# EasyEDA Pro project car1.eprj, schematic Schematic2_2

## Sheets
1 control: Board Name: 主板第三版; Create Date: 2025-05-26; Page Name: control; Project Name: car1; Schematic Name: Schematic2_2; Update Date: 2025-06-05; Company: 嘉立创EDA; Page Size: A4; Version: V1.0
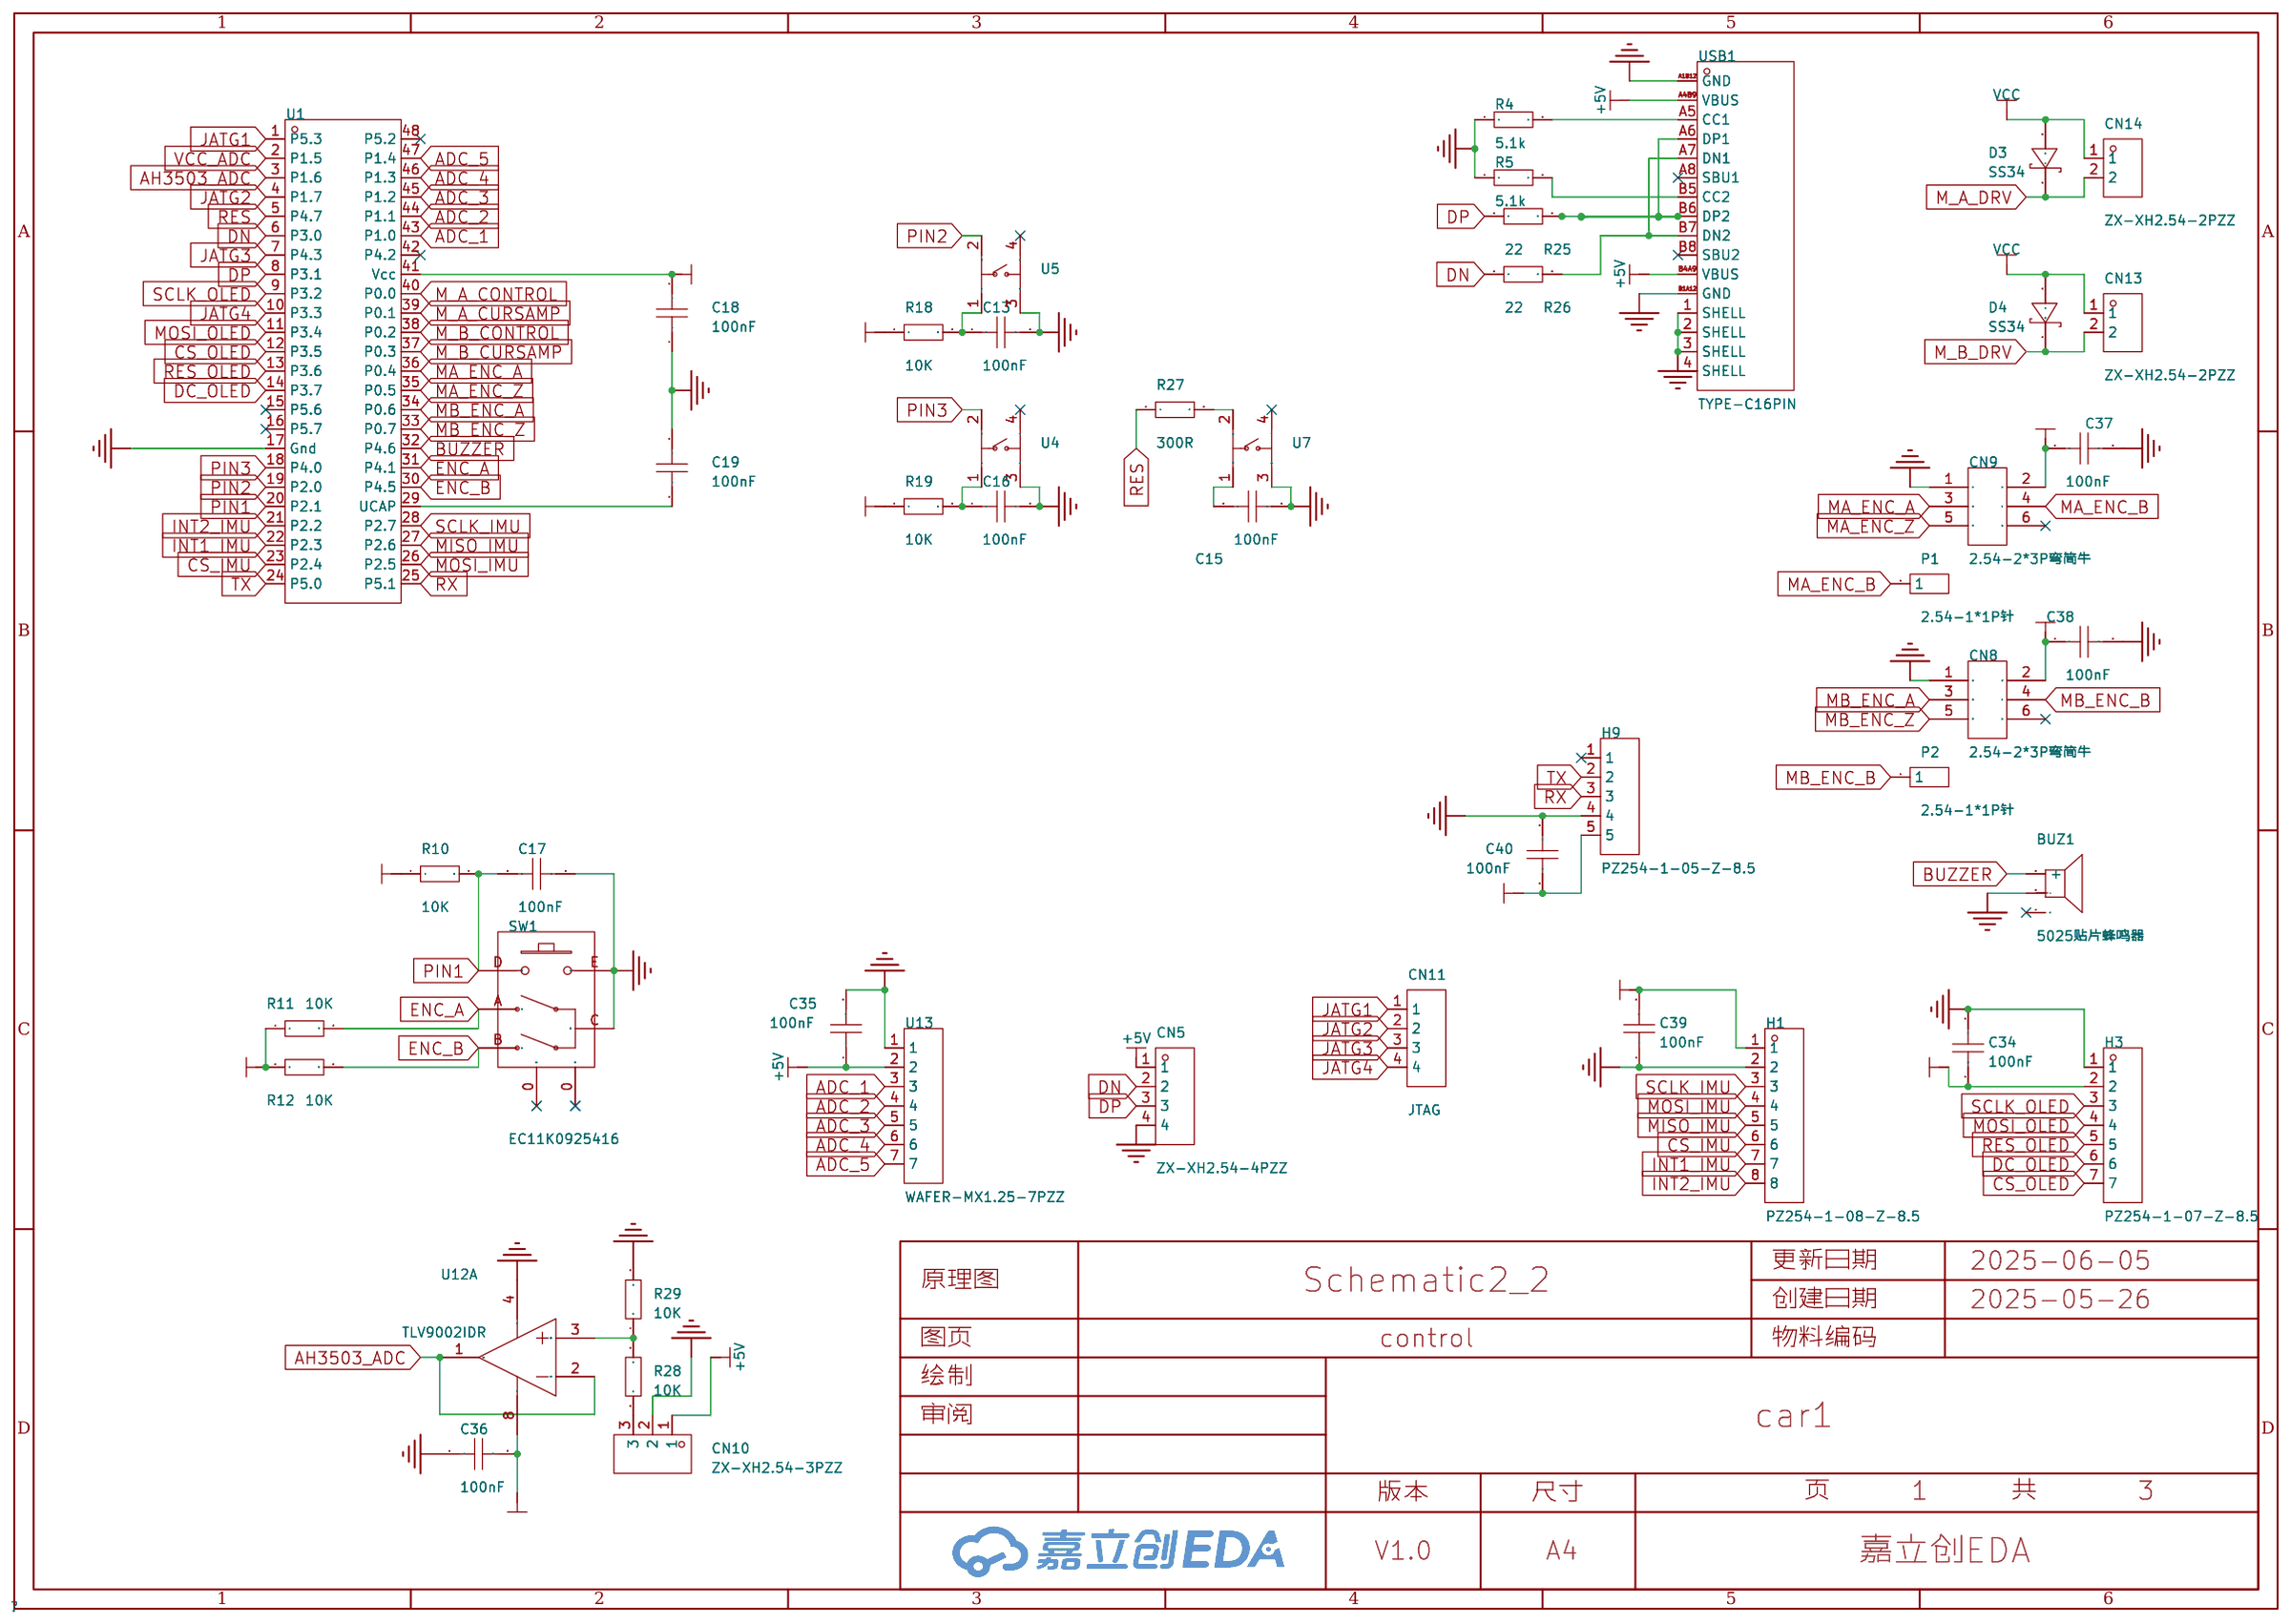
[diagram p7: control]
2 Power: Page Name: Power; Update Date: 2025-06-06
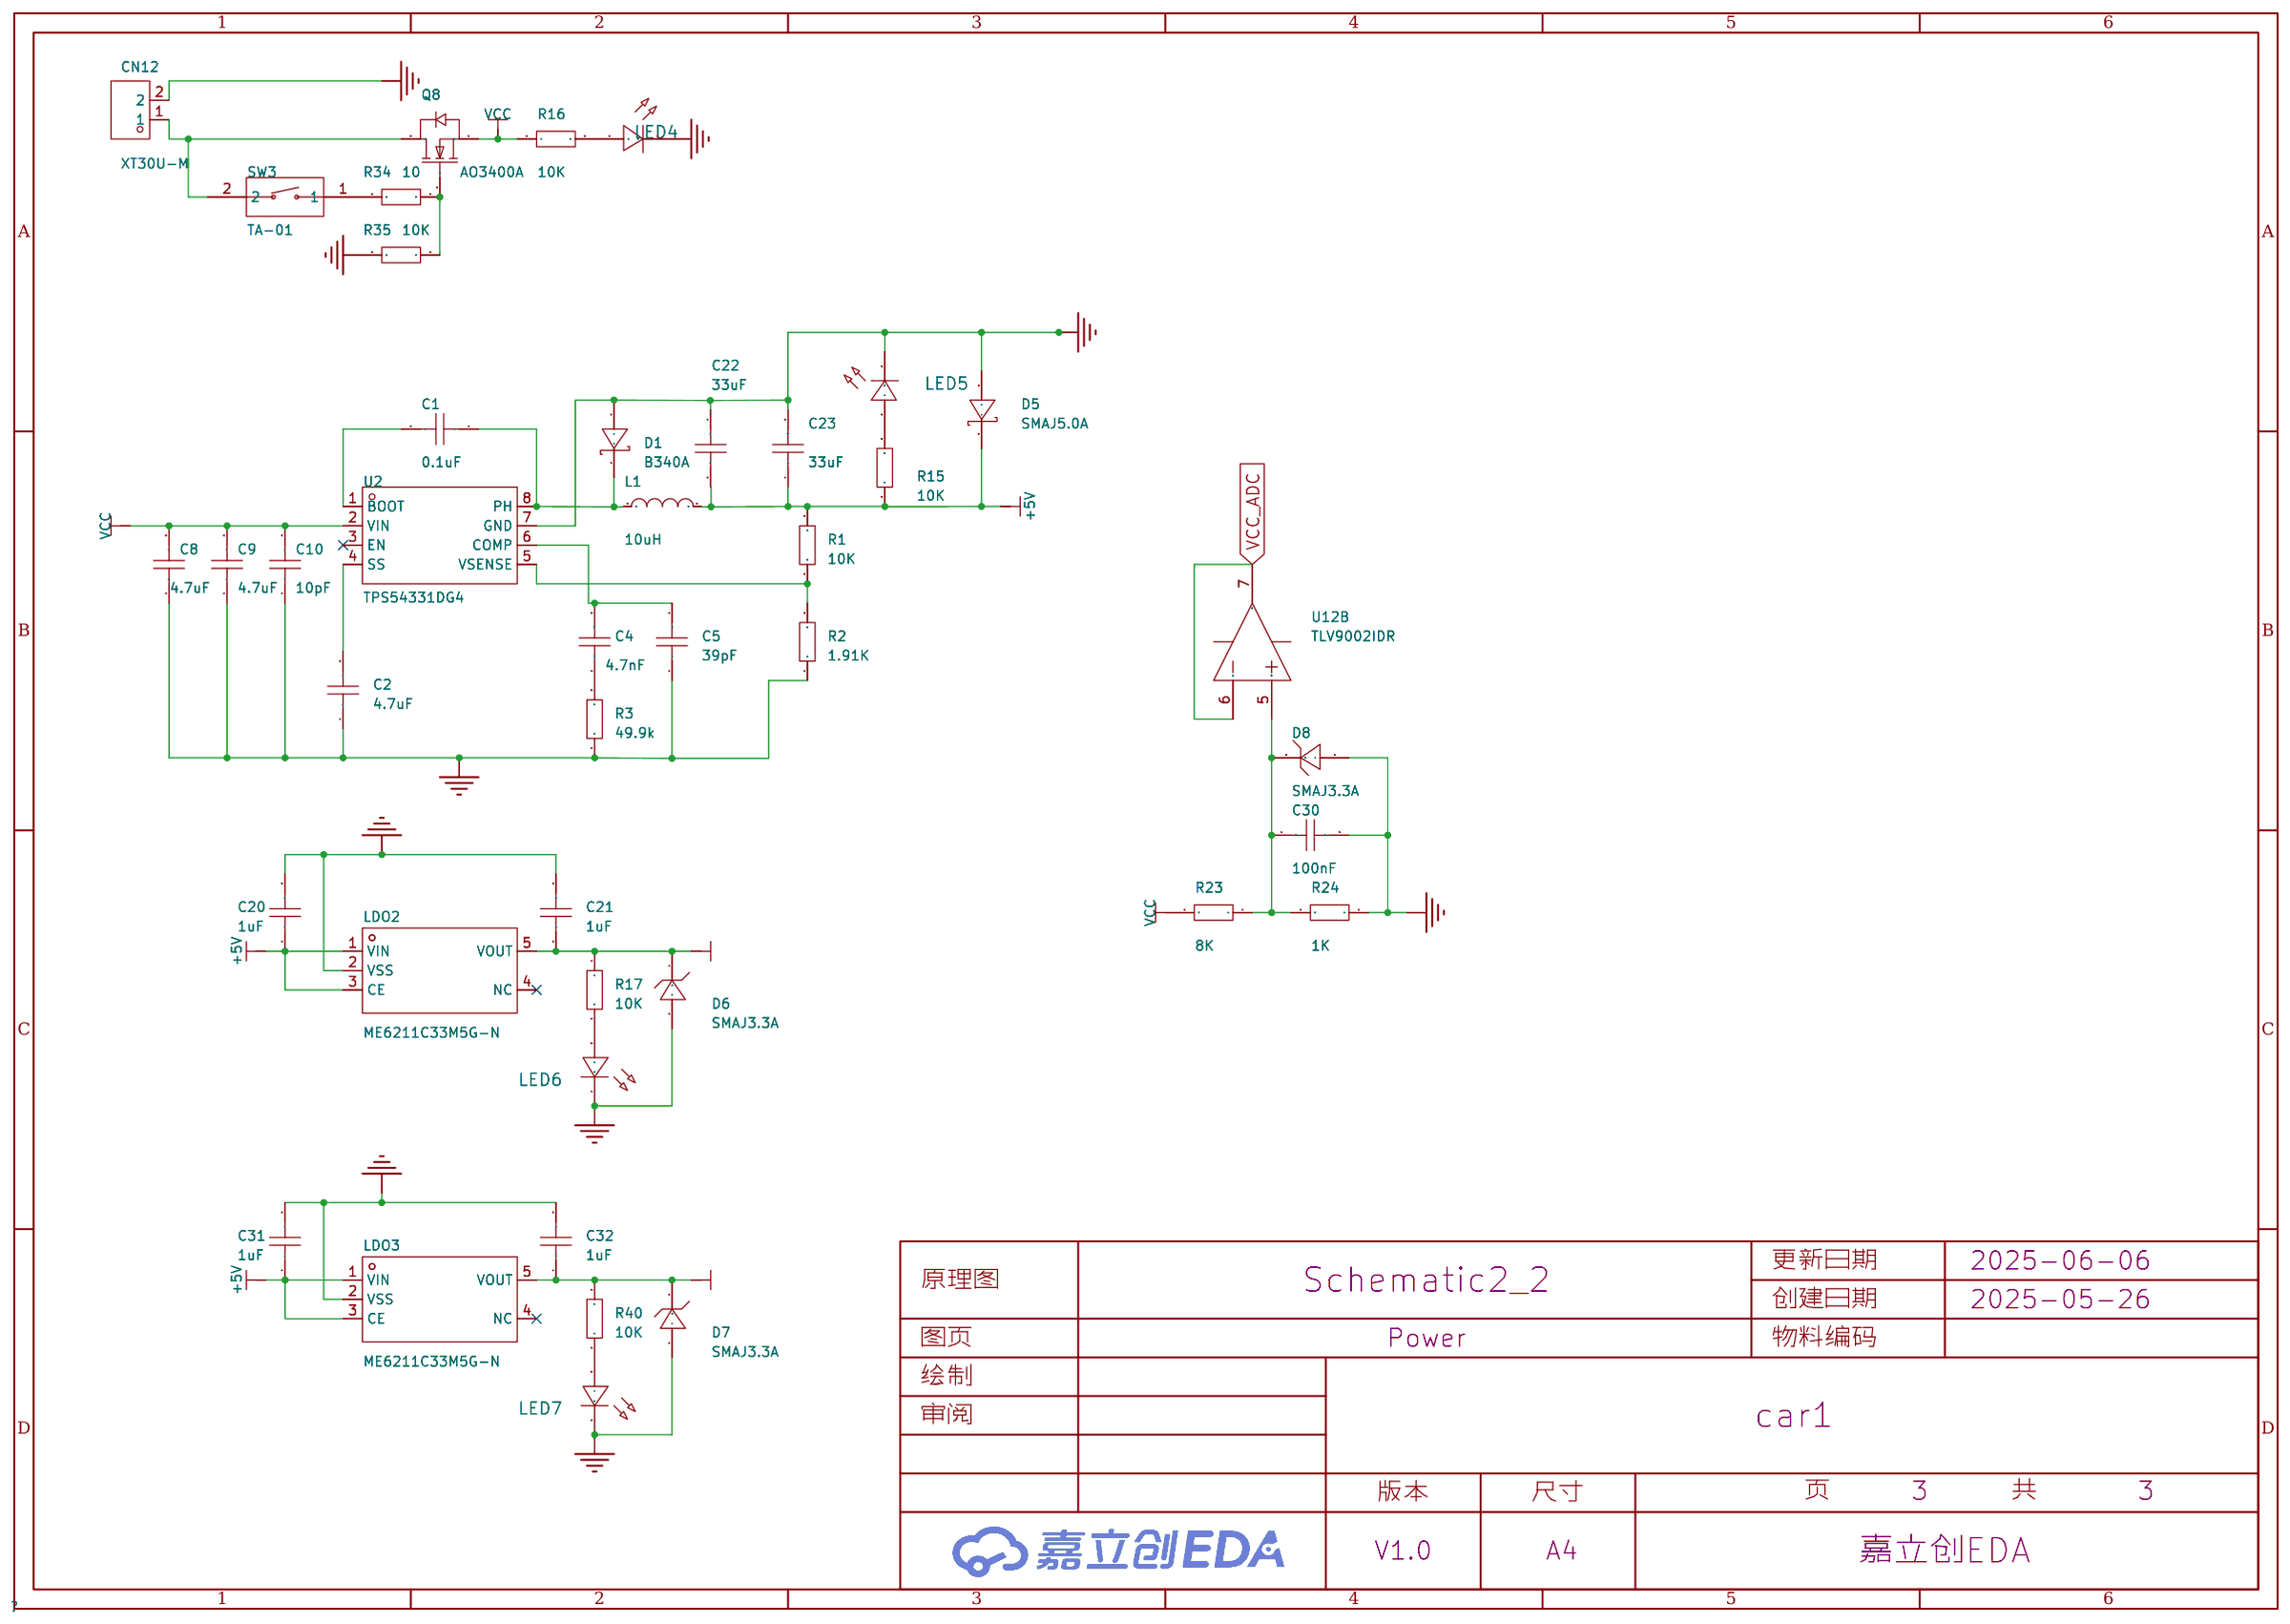
[diagram p8: Power]
3 Motor_Drive: Page Name: Motor_Drive
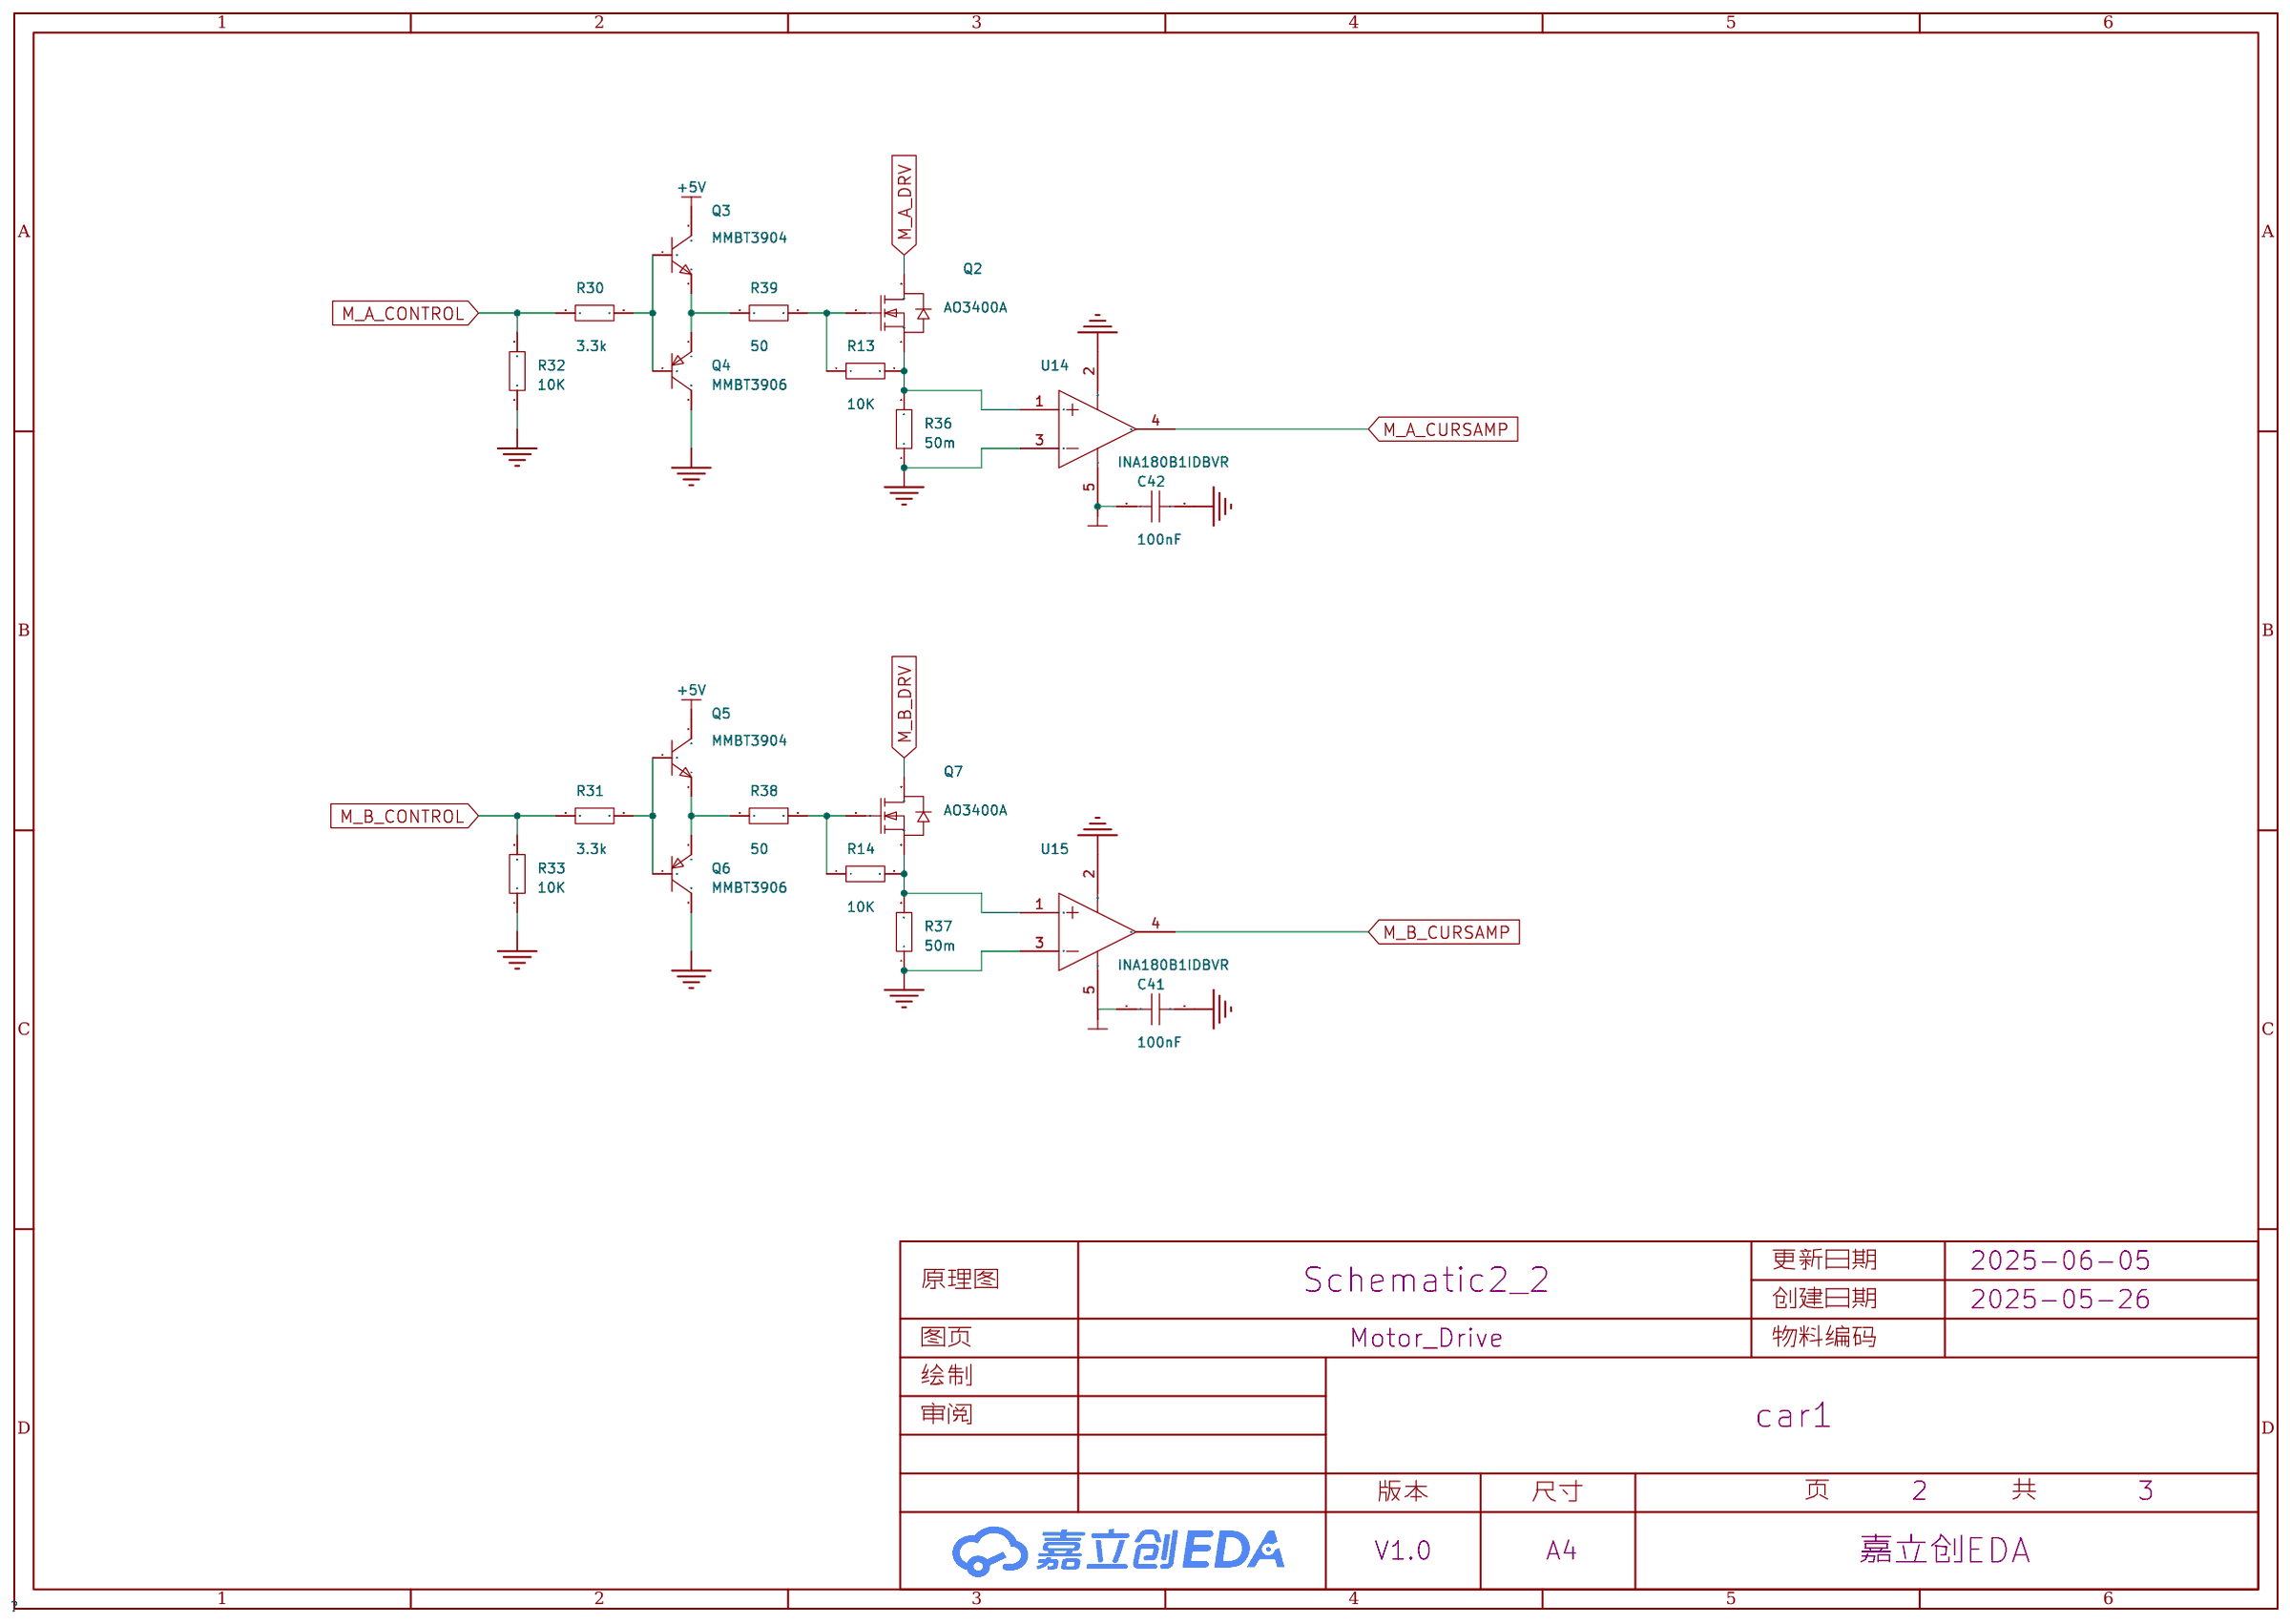
[diagram p9: Motor_Drive]

## Parts
sheet control
BUZ1  5025贴片蜂鸣器  [BUZ-SMD_3P-L5.5-W5.0_5025]
C13  100nF  [C0603]
C15  100nF  [C0603]
C16  100nF  [C0603]
C17  100nF  [C0603]
C18  100nF  [C0603]
C19  100nF  [C0603]
C34  100nF  [C0603]
C35  100nF  [C0603]
C36  100nF  [C0603]
C37  100nF  [C0603]
C38  100nF  [C0603]
C39  100nF  [C0603]
C40  100nF  [C0603]
CN5  ZX-XH2.54-4PZZ  [CONN-TH_4P-P2.50_4PIN]
CN8  2.54-2*3P弯简牛  [IDC-TH_6P-P2.54-H-R2-C3-S2.54]
CN9  2.54-2*3P弯简牛  [IDC-TH_6P-P2.54-H-R2-C3-S2.54]
CN10  ZX-XH2.54-3PZZ  [CONN-TH_3P-P2.54_2501S-3P]
CN11  JTAG  [HDR-TH_4P-P2.54-V-F]
CN13  ZX-XH2.54-2PZZ  [CONN-TH_2P-P2.50_HX25003-2A]
CN14  ZX-XH2.54-2PZZ  [CONN-TH_2P-P2.50_HX25003-2A]
D3  SS34  [SMA_L4.3-W2.6-LS5.2-RD]
D4  SS34  [SMA_L4.3-W2.6-LS5.2-RD]
H1  PZ254-1-08-Z-8.5  [HDR-TH_8P-P2.54-V-M]
H3  PZ254-1-07-Z-8.5  [HDR-TH_07P-P2.54-V-M]
H9  PZ254-1-05-Z-8.5  [HDR-TH_5P-P2.54-V-M]
P1  2.54-1*1P针  [HDR-TH_1P-P2.54-V-M]
P2  2.54-1*1P针  [HDR-TH_1P-P2.54-V-M]
R4  5.1k  [R0603]
R5  5.1k  [R0603]
R10  10K  [R0603]
R11  10K  [R0603]
R12  10K  [R0603]
R18  10K  [R0603]
R19  10K  [R0603]
R25  22  [R0603]
R26  22  [R0603]
R27  300R  [R0603]
R28  10K  [R0603]
R29  10K  [R0603]
SW1  EC11K0925416  [SW-TH_EC11K0925416]
U1  AI8051U-34K64-QFP48  [LQFP-48_L7.0-W7.0-P0.50-LS9.0-BL_1]
U4  TC-6610 6*6*5 160g  [SW-TH_4P-L6.0-W6.0-P4.50-LS6.5]
U5  TC-6610 6*6*5 160g  [SW-TH_4P-L6.0-W6.0-P4.50-LS6.5]
U7  TC-6610 6*6*5 160g  [SW-TH_4P-L6.0-W6.0-P4.50-LS6.5]
U12  TLV9002IDR  [SOIC-8_L4.9-W3.9-P1.27-LS6.0-BL]  (sections 1,2)
U13  WAFER-MX1.25-7PZZ  [CONN-TH_7P-P1.25_XUNPU_WAFER-MX1.25-7PZZ]
USB1  TYPE-C16PIN  [USB-C-SMD_TYPE-C16PIN]
sheet Motor_Drive
C41  100nF  [C0603]
C42  100nF  [C0603]
Q2  AO3400A  [SOT-23-3_L2.9-W1.3-P1.90-LS2.4-BR]
Q3  MMBT3904  [SOT-23-3_L2.9-W1.3-P1.90-LS2.4-BR]
Q4  MMBT3906  [SOT-23-3_L2.9-W1.3-P1.90-LS2.4-BR]
Q5  MMBT3904  [SOT-23-3_L2.9-W1.3-P1.90-LS2.4-BR]
Q6  MMBT3906  [SOT-23-3_L2.9-W1.3-P1.90-LS2.4-BR]
Q7  AO3400A  [SOT-23-3_L2.9-W1.3-P1.90-LS2.4-BR]
R13  10K  [R0603]
R14  10K  [R0603]
R30  3.3k  [R0603]
R31  3.3k  [R0603]
R32  10K  [R0603]
R33  10K  [R0603]
R36  50m  [R0603]
R37  50m  [R0603]
R38  50  [R0603]
R39  50  [R0603]
U14  INA180B1IDBVR  [SOT-23-5_L2.9-W1.6-P0.95-LS2.8-BR]
U15  INA180B1IDBVR  [SOT-23-5_L2.9-W1.6-P0.95-LS2.8-BR]
sheet Power
C1  0.1uF  [C0603]
C2  4.7uF  [C0603]
C4  4.7nF  [C0603]
C5  39pF  [C0603]
C8  4.7uF  [C0603]
C9  4.7uF  [C0603]
C10  10pF  [C0603]
C20  1uF  [C0603]
C21  1uF  [C0603]
C22  33uF  [C0603]
C23  33uF  [C0603]
C30  100nF  [C0603]
C31  1uF  [C0603]
C32  1uF  [C0603]
CN12  XT30U-M  [CONN-TH_XT30U-M]
D1  B340A  [SMA_L4.3-W2.6-LS5.1-RD]
D5  SMAJ5.0A  [SMA_L4.4-W2.6-LS5.0-RD]
D6  SMAJ3.3A  [SMA_L4.3-W2.7-LS5.1-RD]
D7  SMAJ3.3A  [SMA_L4.3-W2.7-LS5.1-RD]
D8  SMAJ3.3A  [SMA_L4.3-W2.7-LS5.1-RD]
L1  10uH  [IND-SMD_L4.9-W4.4_MAPM0420F]
LDO2  ME6211C33M5G-N  [SOT-23-5_L3.0-W1.7-P0.95-LS2.8-BL]
LDO3  ME6211C33M5G-N  [SOT-23-5_L3.0-W1.7-P0.95-LS2.8-BL]
LED4  -  [LED_0603]
LED5  -  [LED_0603]
LED6  -  [LED_0603]
LED7  -  [LED_0603]
Q8  AO3400A  [SOT-23-3_L2.9-W1.3-P1.90-LS2.4-BR]
R1  10K  [R0603]
R2  1.91K  [R0603]
R3  49.9k  [R0603]
R15  10K  [R0603]
R16  10K  [R0603]
R17  10K  [R0603]
R23  8K  [R0603]
R24  1K  [R0603]
R34  10  [R0603]
R35  10K  [R0603]
R40  10K  [R0603]
SW3  TA-01  [SW-TH_2P-L4.1-W9.6-P2.54-LS7.62]
U2  TPS54331DG4  [SOIC-8_L4.9-W3.9-P1.27-LS6.0-BL]

## Library data of the parts
BUZ1 = 5025贴片蜂鸣器: Supplier Part: C9900027059; Supplier Footprint: BUZ-SMD; JLCPCB Part Class: 扩展库; Supplier: LCSC
C2 C4 C5 C8-C10 C13 C15-C21 C31 C32 = CAP_0402: Supplier Footprint: 0402
C22 C23 C30 C34-C42 = CAP_0603: Supplier Footprint: 0603
CN5 = ZX-XH2.54-4PZZ: 插针结构:1x4P;间距:2.54mm;安装方式:直插;参考系列:XH;总PIN数:4P;排数:1;每排PIN数:4;行距:-;额定电流:3A;触头材质:黄铜;触头镀层:锡;工作温度范围:-25℃~+85℃;; Supplier Part: C7429634; Manufacturer: Megastar(兆星); Supplier Footprint: 插件,P=2.5mm; JLCPCB Part Class: 扩展库; Datasheet: https://atta.szlcsc.com/upload/public/pdf/source/20230619/B529A2163E0159A644AB3383D208FB03.pdf; Supplier: LCSC; Pins Structure: 1x4P; Pitch: 2.54mm; Mounting Style: 直插; Reference Series: XH; Number of Pins: 4P; Number of Rows: 1; Number of PINs Per Row: 4; Current Rating (Max): 3A; Contact Material: 黄铜; Contact Plating: 锡; Operating Temperature Range: -25℃~+85℃
CN8 CN9 = 2.54-2*3P弯简牛: 连接器类型:简牛座;间距:2.54mm;结构:2x3P;封装形式:弯插;行距:2.54mm;排数:2;每排PIN数:3;触头材质:-;触头镀层:-;; LCSC Part Name: 2.54mm 2x3P 排数:2 每排P数:3; Supplier Part: C34945; Manufacturer: BOOMELE(博穆精密); Supplier Footprint: 弯插,P=2.54mm; JLCPCB Part Class: 扩展库; Datasheet: https://atta.szlcsc.com/upload/public/pdf/source/20151118/1457707580629.pdf; Supplier: LCSC; Connector Type: 简牛座; Pitch: 2.54mm; Structure: 2x3P; Holder Type: 弯插; Row Spacing: 2.54mm; Number of Rows: 2; Pin Number in each Row: 3
CN10 = ZX-XH2.54-3PZZ: 插针结构:1x3P;间距:2.54mm;安装方式:直插;参考系列:XH;总PIN数:3P;排数:1;每排PIN数:3;行距:-;额定电流:3A;触头材质:黄铜;触头镀层:锡;工作温度范围:-25℃~+85℃;; Supplier Part: C7429633; Manufacturer: Megastar(兆星); Supplier Footprint: 插件,P=2.54mm; JLCPCB Part Class: 扩展库; Datasheet: https://atta.szlcsc.com/upload/public/pdf/source/20230619/AE17037A2CFDBE8D9CBA775D61AD0A84.pdf; Supplier: LCSC; Pins Structure: 1x3P; Pitch: 2.54mm; Mounting Style: 直插; Reference Series: XH; Number of Pins: 3P; Number of Rows: 1; Number of PINs Per Row: 3; Current Rating (Max): 3A; Contact Material: 黄铜; Contact Plating: 锡; Operating Temperature Range: -25℃~+85℃
CN11 = JTAG: Supplier Part: C9900002996; Supplier Footprint: CONN-TH_P2.54-4P; JLCPCB Part Class: 扩展库; Supplier: LCSC
CN13 CN14 = ZX-XH2.54-2PZZ: 插针结构:1x2P;间距:2.54mm;安装方式:直插;参考系列:XH;总PIN数:2P;排数:1;每排PIN数:2;行距:-;额定电流:3A;触头材质:黄铜;触头镀层:锡;工作温度范围:-25℃~+85℃;; Supplier Part: C7429632; Manufacturer: Megastar(兆星); Supplier Footprint: 插件,P=2.54mm; JLCPCB Part Class: 扩展库; Datasheet: https://atta.szlcsc.com/upload/public/pdf/source/20230619/19BA6947230AA44A04D3EDD65E618FD0.pdf; Supplier: LCSC; Pins Structure: 1x2P; Pitch: 2.54mm; Mounting Style: 直插; Reference Series: XH; Number of Pins: 2P; Number of Rows: 1; Number of PINs Per Row: 2; Current Rating (Max): 3A; Contact Material: 黄铜; Contact Plating: 锡; Operating Temperature Range: -25℃~+85℃
D3 D4 = SS34_C8678: 二极管配置:独立式;正向压降(Vf):550mV@3A;直流反向耐压(Vr):40V;整流电流:3A;; LCSC Part Name: 电压:40V 电流:3A; Supplier Part: C8678; Manufacturer: MDD(辰达半导体); Supplier Footprint: SMA(DO-214AC); JLCPCB Part Class: 基础库; Datasheet: https://atta.szlcsc.com/upload/public/pdf/source/20240710/2118BB86FDDB2E0B294389AC1F3F65C8.pdf; Supplier: LCSC; Diode Configuration: 独立式; Forward Voltage (Vf@If): 550mV@3A; Reverse Voltage (Vr): 40V; Rectified Current: 3A; Reverse Leakage Current (Ir): 500uA@40V
H1 = PZ254-1-08-Z-8.5: 插针结构:1x8P;间距:2.54mm;行距:-;圆针/方针:方针;安装类型:直插;排数:单排;总PIN位数:8P;额定电流:3A;额定电压:-;配合针长度:6mm;塑高:2.5mm;端接针长度:3mm;触头材质:黄铜;工作温度范围:-40℃~+105℃;焊接温度(最大值):260℃@10S;颜色:黑色;; LCSC Part Name: 1x8P 间距:2.54mm 方针 直插; Supplier Part: C2894931; Manufacturer: HCTL(华灿天禄); Supplier Footprint: 插件,P=2.54mm; JLCPCB Part Class: 扩展库; Datasheet: https://atta.szlcsc.com/upload/public/pdf/source/20240305/0F0A2A5C422E5D195558C9C26715A031.pdf; Supplier: LCSC; Pin Structure: 1x8P; Pitch: 2.54mm; Circluar Pins/Square Pins: 方针; Mounting Type: 直插; Number of Rows: 单排; Number of Pins: 8P; Current Rating (Max): 3A; Length of Mating Pin: 6mm; Insulation Height: 2.5mm; Length of End Connection Pin: 3mm; Contact Material: 黄铜; Operating Temperature Range: -40℃~+105℃; Soldering Temperature(Max): 260℃@10S; Color: 黑色
H3 = PZ254-1-07-Z-8.5: 插针结构:1x7P;间距:2.54mm;行距:-;圆针/方针:方针;安装类型:直插;排数:单排;总PIN位数:7P;额定电流:3A;额定电压:-;配合针长度:6mm;塑高:2.5mm;端接针长度:3mm;触头材质:黄铜;工作温度范围:-40℃~+105℃;焊接温度(最大值):260℃@10S;颜色:黑色;; LCSC Part Name: 1x7P 间距:2.54mm 方针 直插; Supplier Part: C2894930; Manufacturer: HCTL(华灿天禄); Supplier Footprint: 插件,P=2.54mm; JLCPCB Part Class: 扩展库; Datasheet: https://atta.szlcsc.com/upload/public/pdf/source/20240305/0F0A2A5C422E5D195558C9C26715A031.pdf; Supplier: LCSC; Pin Structure: 1x7P; Pitch: 2.54mm; Circluar Pins/Square Pins: 方针; Mounting Type: 直插; Number of Rows: 单排; Number of Pins: 7P; Current Rating (Max): 3A; Length of Mating Pin: 6mm; Insulation Height: 2.5mm; Length of End Connection Pin: 3mm; Contact Material: 黄铜; Operating Temperature Range: -40℃~+105℃; Soldering Temperature(Max): 260℃@10S; Color: 黑色
H9 = PZ254-1-05-Z-8.5: 插针结构:1x5P;间距:2.54mm;行距:-;圆针/方针:方针;安装方式:直插;排数:单排;总PIN位数:5P;额定电流:3A;额定电压:-;配合针长度:6mm;塑高:2.5mm;端接针长度:3mm;触头材质:黄铜;工作温度:-40℃~+105℃;颜色:黑色;; LCSC Part Name: 1x5P 间距:2.54mm 方针 直插; Supplier Part: C2894928; Manufacturer: HCTL(华灿天禄); Supplier Footprint: 插件,P=2.54mm; JLCPCB Part Class: 扩展库; Datasheet: https://atta.szlcsc.com/upload/public/pdf/source/20240305/0F0A2A5C422E5D195558C9C26715A031.pdf; Supplier: LCSC; Pin Structure: 1x5P; Pitch: 2.54mm; Circluar Pins/Square Pins: 方针; Mounting Type: 直插; Number of Rows: 单排; Number of Pins: 5P; Current Rating: 3A; Length of Mating Pin: 6mm; Insulation Height: 2.5mm; Length of End Connection Pin: 3mm; Contact Material: 黄铜; Operating Temperature: -40℃~+105℃; Color: 黑色
P1 P2 = 2.54-1*1P针: 插针结构:-;间距:-;行距:-;圆针/方针:-;安装方式:直插;排数:单排;总PIN位数:1P;额定电流:-;额定电压:-;配合针长度:-;塑高:-;触头材质:-;触头镀层:-;颜色:黑色;; LCSC Part Name: 直插; Supplier Part: C81276; Manufacturer: BOOMELE(博穆精密); Supplier Footprint: 插件,P=2.54mm; JLCPCB Part Class: 扩展库; Datasheet: https://atta.szlcsc.com/upload/public/pdf/source/20221018/3E9408392E35E6F57A28985E5F7BF5C9.pdf; Supplier: LCSC; Mounting Type: 直插; Number of Rows: 单排; Number of Pins: 1P; Color: 黑色
R1-R5 R10-R17 R40 = Res_0402: Supplier Footprint: 0402
R18 R19 R23-R39 = Res_0603: Supplier Footprint: 0603
SW1 = EC11K0925416: Supplier Part: C219777; Manufacturer: ALPSALPINE(阿尔卑斯阿尔派); Supplier Footprint: 插件; JLCPCB Part Class: 扩展库; Datasheet: https://atta.szlcsc.com/upload/public/pdf/source/20220222/29C2476E448AF88AA1E99A46D9435970.pdf; Supplier: LCSC
U1 = AI8051U-34K64-QFP48: 硬件浮点/硬件三角函数 跑100MHz, 32位8051-CPU 跑 42MHz，PWM 有硬件移相功能，DMA支持外设到外设，DMA支持PWM; Supplier Part: C41427635; Manufacturer: STC; Supplier Footprint: QFP-48; JLCPCB Part Class: 扩展库; Datasheet: https://atta.szlcsc.com/upload/public/pdf/source/20241012/98E0A3F17C9CC280218AE3F266CCDE47.pdf; Supplier: LCSC
U4 U5 U7 = TC-6610 6*6*5 160g: 轻触开关  6*6*5 160g力 4.3基座 复银 耐温 ROHS; Supplier Part: C7528706; Manufacturer: FG(富港); Supplier Footprint: 插件,6x6mm; JLCPCB Part Class: 扩展库; Datasheet: https://atta.szlcsc.com/upload/public/pdf/source/20240119/C4B5B07B03893BE63D1CA58047A0B7F3.pdf; Supplier: LCSC
U12 = TLV9002IDR: 放大器数:双路;轨到轨:-;增益带宽积(GBP):-;输入失调电压(Vos):1.6mV;压摆率(SR):2V/us;输入偏置电流(Ib):5pA;; Supplier Part: C398360; Manufacturer: TI(德州仪器); Supplier Footprint: SOIC-8; JLCPCB Part Class: 扩展库; Datasheet: https://www.ti.com/cn/lit/gpn/tlv9001; Supplier: LCSC; Number of Channels: 双路; Maximum Power Supply Range (Vdd-Vss): 5.5V; Vos - Input Offset Voltage: 1.6mV; Input Offset Voltage Drift(Vos TC): 0.6uV/℃; Slew Rate: 2V/us; Ib - Input Bias Current: 5pA; Noise density(eN): 4.7nV/√Hz@1kHz; Common Mode Rejection Ratio(CMRR): 86dB; Operating Temperature: -40℃~+125℃; Single supply: 1.8V~5.5V
U13 = WAFER-MX1.25-7PZZ: 插针结构:1x7P;间距:1.25mm;安装方式:直插;参考系列:PicoBlade(MX 1.25);总PIN数:7P;排数:1;每排PIN数:7;行距:-;额定电流:1A;触头材质:黄铜;触头镀层:-;工作温度:-25℃~+85℃;; LCSC Part Name: 1x7P 间距:1.25mm 直插 系列:PicoBlade(MX 1.25); Supplier Part: C3029400; Manufacturer: XUNPU(讯普); Supplier Footprint: 插件,P=1.25mm; JLCPCB Part Class: 扩展库; Datasheet: https://atta.szlcsc.com/upload/public/pdf/source/20220527/74EE44A637E2E6AE073051F308D41465.pdf; Supplier: LCSC; Pins Structure: 1x7P; Pitch: 1.25mm; Mounting Type: 直插; Reference Series: PicoBlade(MX 1.25); Number of Pins: 7P; Number of Rows: 1; Number of PINs Per Row: 7; Current Rating: 1A; Contact Material: 黄铜; Operating Temperature: -25℃~+85℃; Voltage Rating: 125V; Plastic Material: LCP; Color: 米色; Z-Height of the Board: 4.6mm; Y-Width of Bottom Edge on Board: 3.3mm
USB1 = TYPE-C16PIN: 连接器类型:Type-C;标准:USB 3.1;公母:母;安装方式:卧贴;触点数量:16P;端口数量:1;额定电流 - 电源:3A;工作温度范围:-40℃~+85℃;; LCSC Part Name: Type-C 母 卧贴; Supplier Part: C393939; Manufacturer: SHOU HAN(首韩); Supplier Footprint: SMD; JLCPCB Part Class: 扩展库; Datasheet: https://atta.szlcsc.com/upload/public/pdf/source/20190521/C393939_7B9043D4CF1026AF443AB60D91FBCD5C.pdf; Supplier: LCSC; Connector Type: Type-C; Standard: USB 3.1; Gender: 母; Mounting Style: 卧贴; Number of Contacts: 16P; Number of Ports: 1; Current Rating - Power (Max): 3A; Operating Temperature Range: -40℃~+85℃; Rated Voltage (Max): 30V; Connect-Disconnect Life: 1万次; Core Colour: 黑色
Q2 Q7 Q8 = AO3400A_C20917: 类型:1个N沟道;漏源电压(Vdss):30V;连续漏极电流(Id):5.7A;导通电阻(RDS(on)@Vgs,Id):26.5mΩ@10V,5.7A;功率(Pd):1.4W;阈值电压(Vgs(th)@Id):1.5V@250uA;; LCSC Part Name: 1个N沟道 耐压:30V 电流:5.7A; Supplier Part: C20917; Manufacturer: AOS; Supplier Footprint: SOT-23-3L; JLCPCB Part Class: 基础库; Datasheet: https://atta.szlcsc.com/upload/public/pdf/source/20140107/1457706668533.pdf; Supplier: LCSC; Type: 1个N沟道; Drain Source Voltage (Vdss): 30V; Continuous Drain Current (Id): 5.7A; Drain Source On Resistance (RDS(on)@Vgs,Id): 26.5mΩ@10V,5.7A; Power Dissipation (Pd): 1.4W; Gate Threshold Voltage (Vgs(th)@Id): 1.5V@250uA; Total Gate Charge (Qg@Vgs): 7nC@4.5V; Input Capacitance (Ciss@Vds): 630pF@15V; Operating Temperature: -55℃~+150℃@(Tj)
Q3 Q5 = MMBT3904(RANGE:100-300): 晶体管类型:NPN;集电极电流(Ic):200mA;集射极击穿电压(Vceo):40V;功率(Pd):200mW;直流电流增益(hFE@Ic,Vce):100@10mA,1V;; LCSC Part Name: NPN 电流:200mA 耐压:40V hfe=100~300; Supplier Part: C20526; Manufacturer: CJ(江苏长电/长晶); Supplier Footprint: SOT-23; JLCPCB Part Class: 基础库; Datasheet: https://atta.szlcsc.com/upload/public/pdf/source/20220704/70F575FB75061E03F919270A6BB8BA7F.pdf; Supplier: LCSC; Transistor Type: NPN; Collector Current (Ic): 200mA; Collector-Emitter Breakdown Voltage (Vceo): 40V; Power Dissipation (Pd): 200mW; DC Current Gain (hFE@Ic,Vce): 100@10mA,1V; Transition Frequency (fT): 300MHz; Collector Cut-Off Current (Icbo): 100nA; Collector-Emitter Saturation Voltage (VCE(sat)@Ic,Ib): 300mV@50mA,5mA
Q4 Q6 = MMBT3906_C18195368: Supplier Part: C18195368; Manufacturer: LJ(朗捷）; Supplier Footprint: SOT-23; Datasheet: https://atta.szlcsc.com/upload/public/pdf/source/20230921/EBEA0117477174C76530FD120E2EA419.pdf; Supplier: LCSC
U14 U15 = INA180B1IDBVR: 放大器数:单路;; Supplier Part: C544664; Manufacturer: TI(德州仪器); Supplier Footprint: SOT-23-5; JLCPCB Part Class: 扩展库; Datasheet: https://www.ti.com/cn/lit/gpn/ina180; Supplier: LCSC; Number of Channels: 单路; Supply Current: 260uA; Operating Temperature: -40℃~+125℃
C1 = CAP_0402: MLCC; Supplier Footprint: 0402
CN12 = XT30U-M: 类别:-;类型1:-;; LCSC Part Name: AMASS(艾迈斯)轻量版锂电池插头公头 XT30U-M; Supplier Part: C99101; Manufacturer: AMASS(艾迈斯); JLCPCB Part Class: 扩展库; Datasheet: https://atta.szlcsc.com/upload/public/pdf/source/20170606/1496716542582.pdf; Supplier: LCSC; Type: 插头; Colour: 黄色; InterfaceType: 公头
D1 = B340A: 二极管配置:独立式;正向压降(Vf):550mV@3A;直流反向耐压(Vr):40V;整流电流:3A;; LCSC Part Name: 电压:40V 电流:3A; Supplier Part: C64982; Manufacturer: MDD(辰达半导体); Supplier Footprint: SMA(DO-214AC); JLCPCB Part Class: 扩展库; Datasheet: https://atta.szlcsc.com/upload/public/pdf/source/20240710/591710C3B34CDB7FE3DA92C119E6F598.pdf; Supplier: LCSC; Diode Configuration: 独立式; Forward Voltage (Vf@If): 550mV@3A; Reverse Voltage (Vr): 40V; Rectified Current: 3A; Reverse Leakage Current (Ir): 500uA@40V
D5 = SMAJ5.0A: 反向截止电压(Vrwm):5V;最大钳位电压:9.2V;峰值脉冲电流(Ipp):43.5A;击穿电压:6.4V;; LCSC Part Name: 单向TVS; Supplier Part: C143135; Manufacturer: FMS(美丽微); Supplier Footprint: SMA(DO-214AC); JLCPCB Part Class: 扩展库; Datasheet: https://atta.szlcsc.com/upload/public/pdf/source/20181207/C341549_5F4FA613B7C5DCDA93DF59C5632A7235.pdf; Supplier: LCSC; Reverse Stand-Off Voltage (Vrwm): 5V; Maximum Clamping Voltage: 9.2V; Peak Pulse Current (Ipp): 43.5A; Breakdown Voltage: 6.4V; Type: TVS
D6-D8 = SMAJ3.3A: 反向截止电压(Vrwm):3.3V;钳位电压:8.3V;峰值脉冲电流(Ipp):25A;击穿电压:4.2V;; LCSC Part Name: 单向TVS 3.3V截止 25A峰值脉冲; Supplier Part: C2917853; Manufacturer: ZHIDE(志得); Supplier Footprint: SMA; JLCPCB Part Class: 扩展库; Datasheet: https://atta.szlcsc.com/upload/public/pdf/source/20211123/CCA4B0E600B5A566CDC39785DC4CF110.pdf; Supplier: LCSC; Reverse Stand-Off Voltage (Vrwm): 3.3V; Clamping Voltage: 8.3V; Peak Pulse Current (Ipp): 25A; Voltage - Breakdown: 4.2V; Reverse Leakage Current (Ir): 200uA; Type: TVS
L1 = HA42-4R7MT: 电感值:4.7uH;精度:±20%;额定电流:2A;饱和电流(Isat):3A;; LCSC Part Name: 4.7uH ±20% 3A; Supplier Part: C2936653; Manufacturer: FH(风华); Supplier Footprint: 0420; JLCPCB Part Class: 扩展库; Datasheet: https://atta.szlcsc.com/upload/public/pdf/source/20211228/DF5AAD1C624D1DACD739A51BD94418BC.pdf; Supplier: LCSC; Tolerance: ±20%; Rated Current: 2A; Saturation Current (Isat): 3A; DC Resistance (DCR): 150mΩ
LDO2 LDO3 = ME6211C33M5G-N: 输出类型:固定;最大输入电压:6V;输出电压:3.3V;最大输出电流:500mA;电源纹波抑制比(PSRR):70dB;输出极性:正极;; LCSC Part Name: 输入6V 输出3.3V 500mA; Supplier Part: C82942; Manufacturer: MICRONE(南京微盟); Supplier Footprint: SOT-23-5; JLCPCB Part Class: 扩展库; Datasheet: https://atta.szlcsc.com/upload/public/pdf/source/20170918/C82942_1505727073070976520.pdf; Supplier: LCSC; Output Type: 固定; Maximum Input Voltage: 6V; Output Voltage: 3.3V; MAX Output Current: 500mA; Power Supply Rejection Ratio (PSRR): 70dB; Dropout Voltage: 260mV@(200mA); Output Polarity: 正极; Number of Outputs: 1
LED4-LED7 = LED_0603-R: Supplier Footprint: 0603
SW3 = TA-01: LCSC Part Name: 拨码开关红色01P-180度1PIN间距2.54mm立式直插正拨平拨1位DIP; Supplier Part: C559136; Manufacturer: Yuandi(元迪); Supplier Footprint: 插件; JLCPCB Part Class: 扩展库; Datasheet: https://atta.szlcsc.com/upload/public/pdf/source/20210928/69C098594BEC9F56DCA9E231879E18D8.pdf; Supplier: LCSC
U2 = TPS54331DG4: 功能类型:降压型;输出类型:可调;输入电压:3.5V~28V;输出电压:800mV~25V;输出电流:3A;; Supplier Part: C1356164; Manufacturer: TI(德州仪器); Supplier Footprint: SOIC-8; JLCPCB Part Class: 扩展库; Datasheet: https://www.ti.com/cn/lit/gpn/tps54331; Supplier: LCSC; Function: 降压型; Output Type: 可调; Input Voltage: 3.5V~28V; Output Voltage: 800mV~25V; Output Current: 3A; Switching Frequency: 570kHz; Operating Temperature: -40℃~+150℃@(TJ); Synchronous Rectification: 否; Number of Outputs: 1; Topology: 降压式; Switch tube (built-in/external): 内置

## Nets
3.3V: C21.1 C37.1 C38.1 C39.2 C40.1 CN8.2 CN9.2 D6.1(C) H1.1 H9.5 LDO2.5(VOUT) R10.1 R11.1 R12.1 R17.1
3.3V_1: C18.2 C32.1 C34.1 C36.2 C41.1 C42.1 D7.1(C) H3.2 LDO3.5(VOUT) R18.1 R19.1 R40.1 U1.41(Vcc) U12.8(V+) U14.5(VS) U15.5(VS)
+5V: C20.1 C23.1 C31.1 C35.1 CN5.1 CN10.1 D5.1(K) LDO2.1(VIN) LDO2.3(CE) LDO3.1(VIN) LDO3.3(CE) Q3.3(C) Q5.3(C) R1.2 R15.1 U13.2 USB1.A4B9(VBUS) USB1.B4A9(VBUS)
GND: BUZ1.3(-) C2.1 C5.1 C8.1 C9.1 C10.1 C13.2 C15.2 C16.2 C17.2 C18.1 C19.1 C20.2 C21.2 C22.1 C23.2 C30.2 C31.2 C32.2 C34.2 C35.2 C36.1 C37.2 C38.2 C39.1 C40.2 C41.2 C42.2 CN5.4 CN8.1 CN9.1 CN10.2 CN12.2 D1.2(A) D5.2(A) D6.2(A) D7.2(A) D8.2(A) H1.2 H3.1 H9.4 LDO2.2(VSS) LDO3.2(VSS) LED4.1(C) LED5.1(C) LED6.1(C) LED7.1(C) Q4.3(C) Q6.3(C) R2.1 R3.1 R4.1 R5.1 R24.1 R29.2 R32.1 R33.1 R35.1 R36.1 R37.1 SW1.C SW1.E U1.17(Gnd) U2.7(GND) U4.3 U5.3 U7.3 U12.4(V-) U13.1 U14.2(GND) U14.3(IN-) U15.2(GND) U15.3(IN-) USB1.1(SHELL) USB1.2(SHELL) USB1.3(SHELL) USB1.4(SHELL) USB1.A1B12(GND) USB1.B1A12(GND)
VCC: C8.2 C9.2 C10.2 CN13.1 CN14.1 D3.2(A) D4.2(A) Q8.2(S) R16.1 R23.2 U2.2(VIN)
VCC_ADC: U1.2(P1.5) U12.6(IN2-) U12.7(OUT2)
ADC_1: U1.43(P1.0) U13.3
ADC_2: U1.44(P1.1) U13.4
ADC_3: U1.45(P1.2) U13.5
ADC_4: U1.46(P1.3) U13.6
ADC_5: U1.47(P1.4) U13.7
AH3503_ADC: U1.3(P1.6) U12.1(OUT1) U12.2(IN1-)
BUZZER: BUZ1.2(+) U1.32(P4.6)
CS_IMU: H1.6 U1.23(P2.4)
CS_OLED: H3.7 U1.12(P3.5)
DC_OLED: H3.6 U1.14(P3.7)
DN: CN5.2 R26.1 U1.6(P3.0)
DP: CN5.3 R25.1 U1.8(P3.1)
ENC_A: R11.2 SW1.A U1.31(P4.1)
ENC_B: R12.2 SW1.B U1.30(P4.5)
INT1_IMU: H1.7 U1.22(P2.3)
INT2_IMU: H1.8 U1.21(P2.2)
JATG1: CN11.1 U1.1(P5.3)
JATG2: CN11.2 U1.4(P1.7)
JATG3: CN11.3 U1.7(P4.3)
JATG4: CN11.4 U1.10(P3.3)
M_A_CONTROL: R30.1 R32.2 U1.40(P0.0)
M_A_CURSAMP: U1.39(P0.1) U14.4(OUT)
M_A_DRV: CN14.2 D3.1(K) Q2.3(D)
M_B_CONTROL: R31.1 R33.2 U1.38(P0.2)
M_B_CURSAMP: U1.37(P0.3) U15.4(OUT)
M_B_DRV: CN13.2 D4.1(K) Q7.3(D)
MA_ENC_A: CN9.3 U1.36(P0.4)
MA_ENC_B: CN9.4 P1.1
MA_ENC_Z: CN9.5 U1.35(P0.5)
MB_ENC_A: CN8.3 U1.34(P0.6)
MB_ENC_B: CN8.4 P2.1
MB_ENC_Z: CN8.5 U1.33(P0.7)
MISO_IMU: H1.5 U1.27(P2.6)
MOSI_IMU: H1.4 U1.26(P2.5)
MOSI_OLED: H3.4 U1.11(P3.4)
N20A_CONTROL: Q3.1(B) Q4.1(B) R30.2
N20B_CONTROL: Q5.1(B) Q6.1(B) R31.2
PIN1: C17.1 R10.2 SW1.D U1.20(P2.1)
PIN2: U1.19(P2.0) U5.2
PIN3: U1.18(P4.0) U4.2
RES: R27.1 U1.5(P4.7)
RES_OLED: H3.5 U1.13(P3.6)
RX: H9.3 U1.25(P5.1)
SCLK_IMU: H1.3 U1.28(P2.7)
SCLK_OLED: H3.3 U1.9(P3.2)
TX: H9.2 U1.24(P5.0)
$1N1528: R4.2 USB1.A5(CC1)
$1N1529: R5.2 USB1.B5(CC2)
$1N6312: C19.2 U1.29(UCAP)
$1N10364: C16.1 R19.2 U4.1
$1N10374: C15.1 U7.1
$1N10398: C13.1 R18.2 U5.1
$1N17349: R25.2 USB1.A6(DP1) USB1.B6(DP2)
$1N17383: R26.2 USB1.A7(DN1) USB1.B7(DN2)
$1N24177: R28.1 R29.1 U12.3(IN1+)
$1N30303: R27.2 U7.2
$1N45393: CN10.3 R28.2
$2N526: C1.2 U2.1(BOOT)
$2N663: C2.2 U2.4(SS)
$2N1009: R1.1 R2.2 U2.5(VSENSE)
$2N1098: C4.2 C5.2 U2.6(COMP)
$2N1203: C4.1 R3.2
$2N6020: CN12.1 Q8.3(D) SW3.2
$2N11866: LED4.2(A) R16.2
$2N11894: LED5.2(A) R15.2
$2N11946: LED6.2(A) R17.2
$2N13681: C30.1 D8.1(C) R23.1 R24.2 U12.5(IN2+)
$2N17570: R34.1 SW3.1
$2N17715: Q8.1(G) R34.2 R35.2
$2N19789: LED7.2(A) R40.2
$3N4418: Q7.2(S) R14.2 R37.2 U15.1(IN+)
$3N4505: Q2.2(S) R13.2 R36.2 U14.1(IN+)
$3N4703: Q7.1(G) R14.1 R38.2
$3N4708: Q5.2(E) Q6.2(E) R38.1
$3N4761: Q2.1(G) R13.1 R39.2
$3N4766: Q3.2(E) Q4.2(E) R39.1
Net-(C1-1): C1.1 D1.1(K) U2.8(PH)

Not connected (* = marked no-connect by the designer): BUZ1 1*; C22 2; CN8 6*; CN9 6*; H9 1*; L1 1 2; LDO2 4(NC)*; LDO3 4(NC)*; SW1 0(MH1)*; U1 15(P5.6)* 16(P5.7)* 42(P4.2)* 48(P5.2)*; U2 3(EN)*; U4 4*; U5 4*; U7 4*; USB1 A8(SBU1)* B8(SBU2)*
